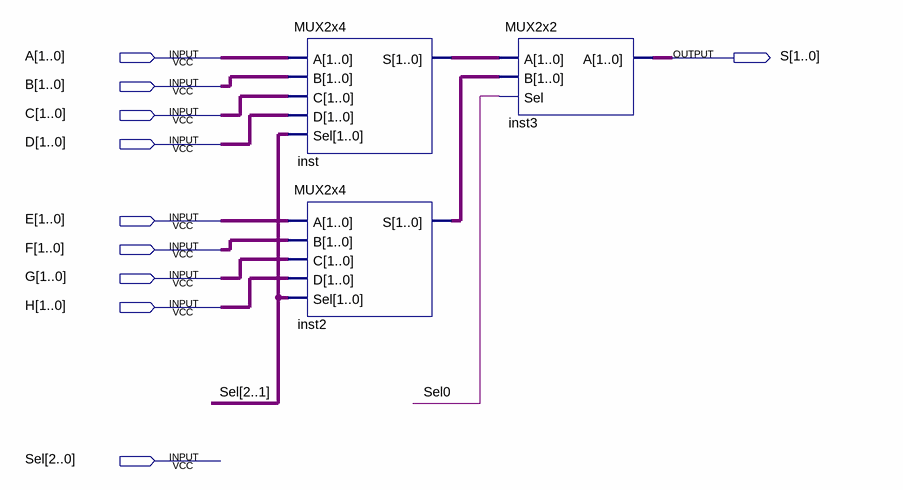
[diagram p0: schematic sheet]
// Quartus schematic MUX2x8.bdf as structural Verilog: 3 symbols, 10 pins
module MUX2x8 (
  input  [1:0] A,
  input  [1:0] B,
  input  [1:0] C,
  input  [1:0] D,
  input  [1:0] E,
  input  [1:0] F,
  input  [1:0] G,
  input  [1:0] H,
  input  [2:0] Sel,
  output [1:0] S
);

  wire [1:0] inst2_s, inst_s;

  MUX2x4 inst (.A(A), .B(B), .C(C), .D(D), .Sel(Sel[2:1]), .S(inst_s));
  MUX2x4 inst2 (.A(E), .B(F), .C(G), .D(H), .Sel(Sel[2:1]), .S(inst2_s));
  MUX2x2 inst3 (.A({inst_s[1], S[1], inst_s[0], S[0]}), .B(inst2_s), .Sel(Sel[0]));
endmodule
